# Altium schematic sheet Private_CPU_RGMII.SchDoc
size D
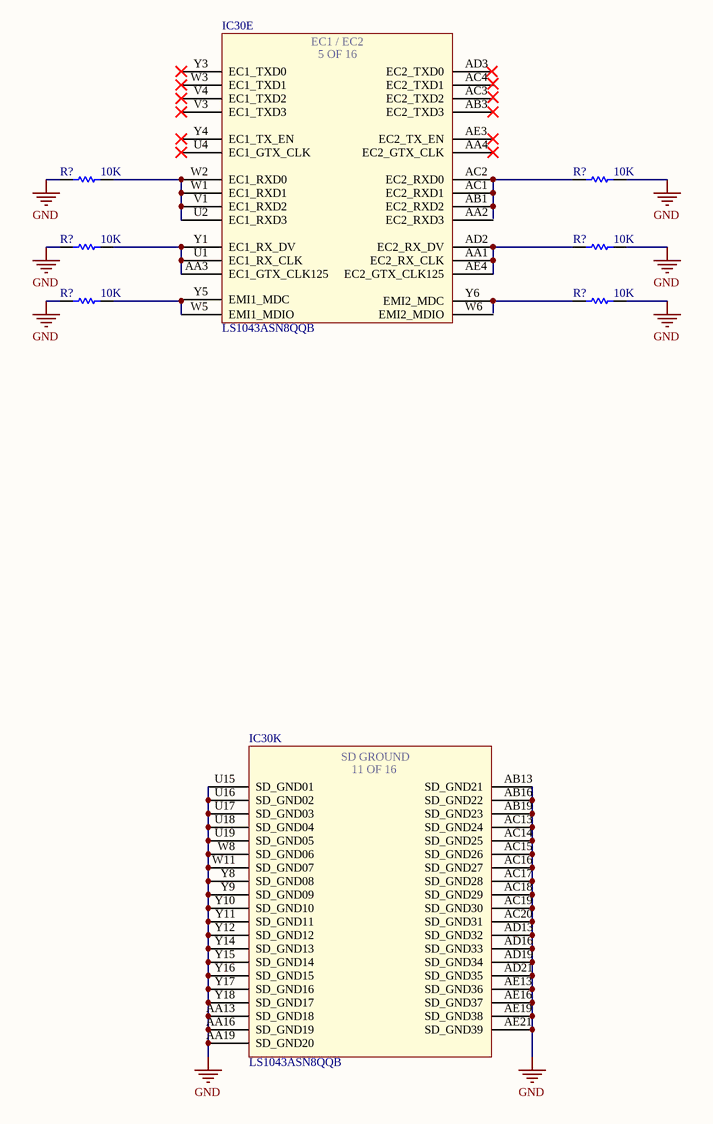
[diagram p0: Private_CPU_RGMII.SchDoc]

## Parts
(Parts that share a designator on the sheet are numbered #1, #2 ... from top to bottom, then left to right.)
IC30  LS1043ASN8QQB  [BGA780C80P28X28_2300X2300X261]  (parts E,K of 16)
R?#1  10K  [RESC1005X40X25LL05T10]
R?#2  10K  [RESC1005X40X25LL05T10]
R?#3  10K  [RESC1005X40X25LL05T10]
R?#4  10K  [RESC1005X40X25LL05T10]
R?#5  10K  [RESC1005X40X25LL05T10]
R?#6  10K  [RESC1005X40X25LL05T10]

## Nets
GND: IC30.AA13(SD_GND18) IC30.AA16(SD_GND19) IC30.AA19(SD_GND20) IC30.AB13(SD_GND21) IC30.AB16(SD_GND22) IC30.AB19(SD_GND23) IC30.AC13(SD_GND24) IC30.AC14(SD_GND25) IC30.AC15(SD_GND26) IC30.AC16(SD_GND27) IC30.AC17(SD_GND28) IC30.AC18(SD_GND29) IC30.AC19(SD_GND30) IC30.AC20(SD_GND31) IC30.AD13(SD_GND32) IC30.AD16(SD_GND33) IC30.AD19(SD_GND34) IC30.AD21(SD_GND35) IC30.AE13(SD_GND36) IC30.AE16(SD_GND37) IC30.AE19(SD_GND38) IC30.AE21(SD_GND39) IC30.U15(SD_GND01) IC30.U16(SD_GND02) IC30.U17(SD_GND03) IC30.U18(SD_GND04) IC30.U19(SD_GND05) IC30.W8(SD_GND06) IC30.W11(SD_GND07) IC30.Y8(SD_GND08) IC30.Y9(SD_GND09) IC30.Y10(SD_GND10) IC30.Y11(SD_GND11) IC30.Y12(SD_GND12) IC30.Y14(SD_GND13) IC30.Y15(SD_GND14) IC30.Y16(SD_GND15) IC30.Y17(SD_GND16) IC30.Y18(SD_GND17) R?#1.1 R?#2.2 R?#3.1 R?#4.2 R?#5.1 R?#6.2
NetIC30_AA1: IC30.AA1(EC2_RX_CLK) IC30.AD2(EC2_RX_DV) IC30.AE4(EC2_GTX_CLK125) R?#4.1
NetIC30_AA3: IC30.AA3(EC1_GTX_CLK125) IC30.U1(EC1_RX_CLK) IC30.Y1(EC1_RX_DV) R?#3.2
NetIC30_AB1: IC30.AB1(EC2_RXD2) IC30.AC1(EC2_RXD1) IC30.AC2(EC2_RXD0) R?#2.1
NetIC30_U2: IC30.U2(EC1_RXD3) IC30.V1(EC1_RXD2) IC30.W1(EC1_RXD1) IC30.W2(EC1_RXD0) R?#1.2
NetIC30_W5: IC30.W5(EMI1_MDIO) IC30.Y5(EMI1_MDC) R?#5.2
NetIC30_Y6: IC30.Y6(EMI2_MDC) R?#6.1

Not connected (* = marked no-connect by the designer): IC30 AA2(EC2_RXD3) AA4(EC2_GTX_CLK)* AB3(EC2_TXD3)* AC3(EC2_TXD2) AC4(EC2_TXD1) AD3(EC2_TXD0) AE3(EC2_TX_EN)* U4(EC1_GTX_CLK)* V3(EC1_TXD3)* V4(EC1_TXD2)* W3(EC1_TXD1)* W6(EMI2_MDIO) Y3(EC1_TXD0)* Y4(EC1_TX_EN)*

## Notes on the sheet
- Title
- Size:
- Date:
- File:
- D
- Number:
- Time:
- Revision:
- Sheet
- of
- (in symbol LS1043ASN8QQB, part E) EC1 / EC2; 5 OF 16
- (in symbol LS1043ASN8QQB, part K) SD GROUND; 11 OF 16

## Library data of the parts
IC30 = LS1043ASN8QQB: Integrated Circuit; Manufacturer_Name: NXP; Datasheet Link: http://www.nxp.com/secured/assets/documents/en/data-sheet/LS1088A.pdf; Height: 2.61mm; Manufacturer_Part_Number: LS1043ASN8QQB; Mouser Part Number: 771-LS1043ASN8QQB; Mouser Price/Stock: https://www.mouser.co.uk/ProductDetail/NXP-Semiconductors/LS1043ASN8QQB/?qs=AQlKX63v8RsTATOTx7X0Jg%3D%3D
R?#1-R?#6 = CMP-2002-07353-1: Part Number: RC0402FR-0710KL; Manufacturer: Yageo / Phycomp